# Altium project AMT5000-24_Oscillator.PrjPcb
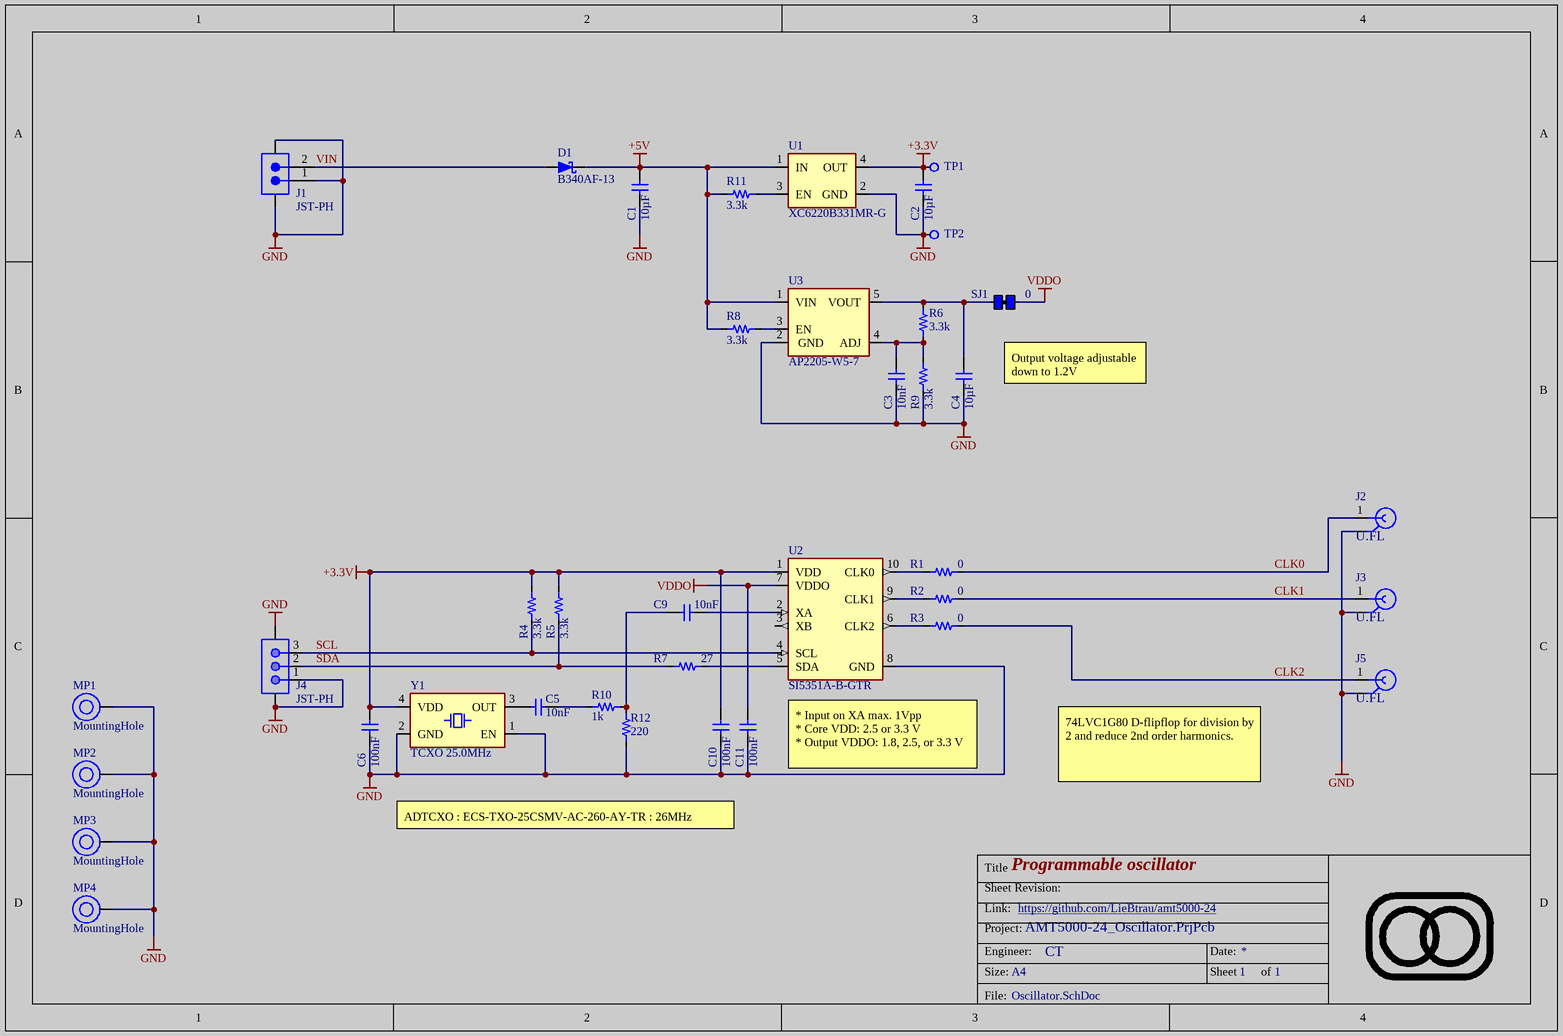
[diagram p0: Oscillator.SchDoc]
assembly_revision: 0; board_name: AMTOSC; board_revision: 1.0; Project_link: https://github.com/LieBtrau/amt5000-24
1 sheet, 38 parts. Net scope: global (net labels, ports and power ports of the same name join across sheets).
Board file: AMTOSC.PcbDoc

## Sheet Oscillator.SchDoc: Programmable oscillator
size A4; Engineer: CT; SheetNumber: 1; SheetTotal: 1

### Parts
C1  value 10µF  [1206-C-N]  (hidden comment: Capacitor 10µF +/-10% 10V X7R 1206)
C2  value 10µF  [1206-C-N]  (hidden comment: Capacitor 10µF +/-10% 10V X7R 1206)
C3  value 10nF  [0603-C-N]  (hidden comment: Capacitor 10nF 50V NP0 0603)
C4  value 10µF  [1206-C-N]  (hidden comment: Capacitor 10µF +/-10% 10V X7R 1206)
C5  value 10nF  [0603-C-N]  (hidden comment: Capacitor 10nF 50V NP0 0603)
C6  value 100nF  [0603-C-N]  (hidden comment: Capacitor 100nF +/-10% 50V X7R 0603)
C9  value 10nF  [0603-C-N]  (hidden comment: Capacitor 10nF 50V NP0 0603)
C10  value 100nF  [0603-C-N]  (hidden comment: Capacitor 100nF +/-10% 50V X7R 0603)
C11  value 100nF  [0603-C-N]  (hidden comment: Capacitor 100nF +/-10% 50V X7R 0603)
D1  B340AF-13  [DO-214AC_UNI]
J1  value JST-PH  [620302124022]  (hidden comment: 620302124022)
J2  U.FL-R-SMT(10)  [HRS-U.FL-R-SMT_V]  (value not drawn)
J3  U.FL-R-SMT(10)  [HRS-U.FL-R-SMT_V]  (value not drawn)
J4  value JST-PH  [620303124022]  (hidden comment: 620303124022)
J5  U.FL-R-SMT(10)  [HRS-U.FL-R-SMT_V]  (value not drawn)
MP1  MountingHole  [PTH-M3D6.5_VIA-RING]  (no BOM)
MP2  MountingHole  [PTH-M3D6.5_VIA-RING]  (no BOM)
MP3  MountingHole  [PTH-M3D6.5_VIA-RING]  (no BOM)
MP4  MountingHole  [PTH-M3D6.5_VIA-RING]  (no BOM)
R1  value 0  [0603-R-N]  (hidden comment: Jumper 0R <50 mOhm 1A 0603)
R2  value 0  [0603-R-N]  (hidden comment: Jumper 0R <50 mOhm 1A 0603)
R3  value 0  [0603-R-N]  (hidden comment: Jumper 0R <50 mOhm 1A 0603)
R4  value 3.3k  [0603-R-N]  (hidden comment: Resistor 3.3k +/-1% 50V 0603)
R5  value 3.3k  [0603-R-N]  (hidden comment: Resistor 3.3k +/-1% 50V 0603)
R6  value 3.3k  [0603-R-N]  (hidden comment: Resistor 3.3k +/-1% 50V 0603)
R7  value 27  [0603-R-N]  (hidden comment: Resistor 27R +/-1% 0.1W 0603)
R8  value 3.3k  [0603-R-N]  (hidden comment: Resistor 3.3k +/-1% 50V 0603)
R9  value 3.3k  [0603-R-N]  (hidden comment: Resistor 3.3k +/-1% 50V 0603)
R10  value 1k  [0603-R-N]  (hidden comment: Resistor 1k +/-1% 50V 0603)
R11  value 3.3k  [0603-R-N]  (hidden comment: Resistor 3.3k +/-1% 50V 0603)
R12  value 220  [0603-R-N]  (hidden comment: Resistor 220R +/-1% 0.1W 0603)
SJ1  value 0  [SJ_0603_1A]  (hidden comment: SJ-0603-1A)  (net tie, no BOM)
TP1  Testpad with multiple sizes  [TP_1.5mm_0.3mmHole]  (value not drawn)  (no BOM)
TP2  Testpad with multiple sizes  [TP_1.5mm_0.3mmHole]  (value not drawn)  (no BOM)
U1  XC6220B331MR-G  [SOT25-N]
U2  SI5351A-B-GTR  [VSSOP10-N]
U3  AP2205-W5-7  [SOT25-N]
Y1  value TCXO 25.0MHz  [WE-SPXO_IQXO-791]  (hidden comment: SX2T25.000B010J020S)

### Nets
+3.3V: C2.2 C6.1 C10.1 R4.2 R5.2 TP1.1(Pad) U1.4(OUT) U2.1(VDD) Y1.4(VDD)
+5V: C1.2 D1.1(K) R8.2 R11.2 U1.1(IN) U3.1(VIN)
GND: C1.1 C2.1 C3.1 C4.1 C6.2 C10.2 C11.2 J1.1 J1.MP1 J1.MP2 J2.2(GND) J3.2(GND) J4.1 J4.MP1 J4.MP2 J5.2(GND) MP1.1(H1) MP2.1(H1) MP3.1(H1) MP4.1(H1) R9.2 R12.1 TP2.1(Pad) U1.2(GND) U2.8(GND) U3.2(GND) Y1.1(EN) Y1.2(GND)
VDDO: C11.1 SJ1.2(R) U2.7(VDDO)
CLK0: J2.1(SIG) R1.1
CLK1: J3.1(SIG) R2.1
CLK2: J5.1(SIG) R3.1
SCL: J4.3 R4.1 U2.4(SCL)
SDA: J4.2 R5.1 R7.1
VIN: D1.2(A) J1.2
NetC3_2: C3.2 R6.2 R9.1 U3.4(ADJ)
NetC4_2: C4.2 R6.1 SJ1.1(L) U3.5(VOUT)
NetC5_1: C5.1 Y1.3(OUT)
NetC5_2: C5.2 R10.1
NetC9_1: C9.1 U2.2(XA)
NetC9_2: C9.2 R10.2 R12.2
NetR1_2: R1.2 U2.10(CLK0)
NetR2_2: R2.2 U2.9(CLK1)
NetR3_2: R3.2 U2.6(CLK2)
NetR7_2: R7.2 U2.5(SDA)
NetR8_1: R8.1 U3.3(EN)
NetR11_1: R11.1 U1.3(EN)

Not connected (* = marked no-connect by the designer): U2 3(XB)

### Notes on the sheet
- Output voltage adjustable down to 1.2V
- * Input on XA max. 1Vpp
  * Core VDD: 2.5 or 3.3 V
  * Output VDDO: 1.8, 2.5, or 3.3 V
- 74LVC1G80 D-flipflop for division by 2 and reduce 2nd order harmonics.
- ADTCXO : ECS-TXO-25CSMV-AC-260-AY-TR : 26MHz
- Title
- Sheet Revision:
- Link:
- Size:
- Project:
- Engineer:
- A4
- Date:
- Sheet
- of
- File:

### Library data of the parts
C1 C2 C4 = CMP-072-000777-17: WCAP-CSGP Multilayer Ceramic Chip Capacitor, General Purpose, size 1206, X7R, 10µF, 10VDC; FLIR Part #: YCAM10U-9; Capacitor Type: MLCC; Technical Reference: X7R1206106K010DFCT10000; Tolerance: 10%; Insulation Resistance: 0.01GO; JLCPCB Part #: C70462; ComponentLink2Description: Datasheet Link; Voltage Rating: 10V; ComponentLink1URL: https://www.we-online.com/redexpert/article/885012208018?ad; ComponentLink2URL: https://www.we-online.com/redexpert/spec/885012208018?ad; Width: 1.6mm; Length: 3.2mm; Mounting Technology: SMT; Max Operating Temperature: 125°C; Case/Package: 1206; ComponentLink1Description: Website Link; Match Code: WCAP-CSGP; Height: 1.6mm; Design Item ID: 885012208018; Min Operating Temperature: -55°C; Usage: General Purpose; Dissipation Factor: 10%; Dielectric: X7R; Pins: 2; Packaging: Tape and Reel; Source: WCAP-CSGP.SchLib
C3 C5 C9 = CMP-001-00137-6: Multilayer Ceramic Capacitor, Grm Series, 0.01 F, 5%, C0g / Np0, 50 V, 0603 [1608 Metric]; FLIR Part #: YCAM10N-7; Temperature Coefficient: 30ppm/°C; Reach SVHC Compliant: No; Case/Package: 0603; Thickness: 0.035inch; Width: 0.8mm; Case Code (Metric): 1608; Termination: SMD/SMT; Min Operating Temperature: -55°C; Voltage Rating (DC): 50V; Mounting Technology: Surface Mount; Package Quantity: 4000; Depth: 0.8mm; Dielectric: C0G; Packaging: Cut Tape; Voltage: 50V; Max Operating Temperature: 125°C; RoHS Compliant: Yes; Material: Ceramic; Lead Pitch: 0.5mm; Case Code (Imperial): 0603; Tolerance: 5%; Voltage Rating: 50V; Lead Free: Lead Free; Height: 0.8mm; Length: 1.6mm; JLCPCB Part #: C85973; Series: GRM
C6 C10 C11 = CMP-072-000619-16: WCAP-CSGP Multilayer Ceramic Chip Capacitor, General Purpose, size 0603, X7R, 100nF, 50VDC; Dissipation Factor: 3%; Tolerance: 10%; Capacitor Type: MLCC; Insulation Resistance: 5GO; Technical Reference: X7R0603104K050DFCT10000; ComponentLink2Description: Datasheet Link; Dielectric: X7R; ComponentLink2URL: https://www.we-online.com/redexpert/spec/885012206095?ad; Case/Package: 0603; Voltage Rating: 50V; Height: 0.8mm; JLCPCB Part #: C14663; Design Item ID: 885012206095; Pins: 2; Min Operating Temperature: -55°C; Max Operating Temperature: 125°C; Width: 0.8mm; ComponentLink1URL: https://www.we-online.com/redexpert/article/885012206095?ad; Match Code: WCAP-CSGP; Packaging: Tape and Reel; Source: WCAP-CSGP.SchLib; Usage: General Purpose; Length: 1.6mm; ComponentLink1Description: Website Link; Mounting Technology: SMT
D1 = CMP-004-00050-6: Diode 40 V 3A Surface Mount SMAF; Forward Voltage: 500 mV @ 3 A; Max Reverse Voltage (DC): 40V; JLCPCB Part #: C172880; Forward Current: 3A; Mounting Technology: Surface Mount; Case/Package: SMA; RoHS Compliant: Yes; Series: -; Packaging: Cut Tape
J1 = CMP-047-000049-10: WR-WTB SMT Male Vertical Shrouded Header, pitch 2mm, 2p; Rated Current: 2A; Contact Resistance: 20mOhm; Withstanding Voltage: 800VAC; Working Voltage: 100VAC; Pin Number: 2; Operating Temperature: -25 to +85degC; Pitch: 2mm; Packaging: Tape and Reel; Publisher: Wurth Elektronik; JLCPCB Part #: C18077899; Pin Count: 2; Design Item ID: 620302124022; Source: WR-WTB_2.00mm.SchLib; ComponentLink1URL: http://www.we-online.de; Gender: Male; Component Type: Standard; Type: Vertical; Published Date: January 2020; Mounting Technology: SMT; Part Number: 620302124022; ComponentLink2URL: https://www.we-online.com/catalog/datasheet/620302124022.pdf; ComponentLink2Description: Datasheet; ComponentLink1Description: Manufacturer
J2 J3 J5 = CMP-002-00035-12: Ultra Small Surface Mount Coaxial Connector, 50 Ohm, -40 to 90 degC, 3-Pin SMD, RoHS, Tape and Reel; pin to pad: 1>3 2>1+2; Manufacturer: Hirose Electric; Resistance: 50Ohm; Connector Type: RF&Coax; Value: U.FL; Package Reference: U.FL-R-SMT; Datasheet Version: Aug-16; Package Description: 3-Pin Surface Mount Device, Body 2.6 x 2.6 mm; Fastening Type: Snap; Datasheet URL: https://www.hirose.com/product/en/download_file/key_name/U.FL/category/Catalog/doc_file_id/31697/?file_category_id=4&item_id=15&is_series=1; Manufacturer URL: https://www.hirose.com; Contact Plating: Gold; Max Operating Temperature: 90°C; Package Quantity: 2500; Impedance: 50Ohm; JLCPCB Part #: C88373; Packaging: TapeandReel; Min Operating Temperature: -40°C; Mounting Technology: SM; RoHS Compliant: True; Contact Material: Brass; Case/Package: U.FL-R-SMT
J4 = CMP-047-000050-9: WR-WTB SMT Male Vertical Shrouded Header, pitch 2mm, 3p; Contact Resistance: 20mOhm; Withstanding Voltage: 800VAC; Pin Number: 3; Rated Current: 2A; Working Voltage: 100VAC; Type: Vertical; Pin Count: 3; Operating Temperature: -25 to +85degC; Publisher: Wurth Elektronik; ComponentLink2Description: Datasheet; Packaging: Tape and Reel; JLCPCB Part #: C160353; Design Item ID: 620303124022; Gender: Male; Published Date: January 2020; ComponentLink2URL: https://www.we-online.com/catalog/datasheet/620303124022.pdf; Source: WR-WTB_2.00mm.SchLib; Mounting Technology: SMT; Part Number: 620303124022; Pitch: 2mm; Component Type: Standard; ComponentLink1Description: Manufacturer; ComponentLink1URL: http://www.we-online.de
MP1-MP4 = CMP-00028-00004-15: Mounting hole.  Add this so that mounting holes placed in your design don't automagically disappear when you import changes from the schematic.; Pins: 1
R1-R3 = CMP-009-00006-26: Chip Jumper, Thick Film, Jumper, 0603, 100mW, 1A, 0 Ohm, <50 mOhm; FLIR Part #: YRES0E-1; Page Part #: ROQJ0000; Tolerance: 50 mOhm; Voltage Rating: 75V; Elements: 1; Usage: Jumper; Case/Package: 0603; Power Rating: 100mW; Current Rating: 1A; Min Operating Temperature: -55°C; RoHS Compliant: True; Resistor Type: Thick Film; Max Operating Temperature: 155°C; JLCPCB Part #: C21189; Pins: 2; Mounting Technology: SMT
R4-R6 R8 R9 R11 = CMP-009-00243-18: Chip Resistor, Thick Film, General Purpose, 0603, 100mW, 50V, 3.3 kOhm, +/-1%; Page Part #: ROQF3301; Tolerance: 1%; Elements: 1; Usage: General Purpose; Min Operating Temperature: -55°C; Voltage Rating: 50V; JLCPCB Part #: C22978; Max Operating Temperature: 155°C; Power Rating: 100mW; Resistor Type: Thick Film; RoHS Compliant: Yes; Case/Package: 0603; Mounting Technology: SMT; Pins: 2
R7 = CMP-009-00280-11: Res Thick Film 1.6 x 0.8 mm 27 Ohm 1% 0.1W(1/10W) 100ppm/ C Molded SMD Paper T/R; Page Part #: ROQF2709; Elements: 1; Power Rating: 100mW; Usage: General Purpose; Resistor Type: Thick Film; Pins: 2; Max Operating Temperature: 155°C; Case/Package: 0603; Min Operating Temperature: -55°C; Tolerance: 1%; JLCPCB Part #: C25190; Mounting Technology: SMT
R10 = CMP-009-00014-29: Chip Resistor, Thick Film, General Purpose, 0603, 100mW, 50V, 1 kOhm, +/-1%; FLIR Part #: YRES1K-1; Page Part #: ROQF1001; Tolerance: 1%; Elements: 1; JLCPCB Part #: C21190; Pins: 2; Resistor Type: Thick Film; RoHS Compliant: Yes; Case/Package: 0603; Min Operating Temperature: -55°C; Power Rating: 100mW; Mounting Technology: SMT; Usage: General Purpose; Max Operating Temperature: 155°C; Voltage Rating: 50V
R12 = CMP-009-00390-1: Res Thick Film 0603 220 Ohm 1% 0.1W(1/10W) ±100ppm/C Pad SMD T/R Automotive AEC-Q200; Power Rating: 100mW; Voltage Rating: 75V; Temperature Coefficient: 100ppm/°C; Max Operating Temperature: 155°C; Packaging: Tape and Reel; Length: 0.061inch; Case/Package: 0603; Case Code (Imperial): 0603; Lead Free: Lead Free; Max Power Dissipation: 100mW; Tolerance: 1%; Min Operating Temperature: -55°C; Features: Automotive AEC-Q200; Contact Plating: Tin,Matte; Mounting Technology: Surface Mount; Height: 0.022inch; Radiation Hardening: No; Number of Terminations: 2; Width: 0.031inch; JLCPCB Part #: C22962; Case Code (Metric): 1608; Series: RMCF; RoHS Compliant: Yes
SJ1 = CMP-009-00345-4: Solder Jumper, Thick Film, Jumper, 0603, 100mW, 1A, 0 Ohm, <50 mOhm; Voltage Rating: 50V; Elements: 1; Temperature Coefficient: 200ppm/°C; Tolerance: 50 mOhm; Power Rating: 100mW; Pins: 2; JLCPCB Part #: C876125; RoHS Compliant: Yes; Resistor Type: Thick Film; Max Operating Temperature: 155°C; Lead Free: Lead Free; Usage: Jumper; Mounting Technology: SMT; Min Operating Temperature: -55°C; Case/Package: 0603
TP1 TP2 = CMP-027-000000-17: Testpad land; Design Item ID: Testpad; Component Type: Standard; Pin Count: 1
U1 = CMP-019-00081-11: Fixed LDO 3.3V, 1%, 1A, Iq 108uA, -40°C to 85°C; pin to pad: 4>5; Number of Regulators: 1; Max Input Voltage: 6V; Min Input Voltage: 4V; Value: 3V3/1A; Output Voltage: 3.3V; JLCPCB Part #: C86534; Max Operating Temperature: 85°C; Case/Package: SOT-23-5; Mount: SMT; Accuracy: 1%; Number of Outputs: 1; Quiescent Current: 108uA; Output Current: 1A; Min Operating Temperature: -40°C; Output Type: Fixed
U2 = CMP-023-00007-2: IC CLK GENERATOR 160MHZ 10MSOP; Number of Outputs: 3; Operating Supply Voltage: 3.3V; Number of Circuits: 2; PLL: Yes; Clock Frequency: 200MHz; Input: Crystal; Operating Supply Current: 22mA; Max Duty Cycle: 55%; Min Operating Temperature: -40°C; RoHS Compliant: Yes; Pins: 10; Package Quantity: 2500; Series: MultiSynth™; Max Operating Temperature: 85°C; Packaging: Tape and Reel; JLCPCB Part #: C504891; Mounting Technology: Surface Mount; Case/Package: MSOP
U3 = CMP-019-00084-11: Variable LDO 1.24V - 22V, , 250mA, Iq 2.5mA, -40°C to 125°C; Number of Regulators: 1; Max Input Voltage: 24V; Power Supply Rejection Ratio (PSRR): 60dB; Max Operating Temperature: 125°C; Min Operating Temperature: -40°C; JLCPCB Part #: C3001658; Number of Outputs: 1; Quiescent Current: 2.5mA; Output Type: Variable; Case/Package: SOT-25; Mount: SMT; Output Current: 250mA; Output Voltage: 1.24V - 22V
Y1 = CMP-002-001569-1: TCXO 25MHz, 3.3V; Frequency Tolerance: 1ppm; JLCPCB Part #: C5180005

## Assembly variants
A: all parts fitted